# EasyEDA schematic SCH_Nixie clock - v2_2021-07-23.json

## Sheets
1 Circuit diagram - v2
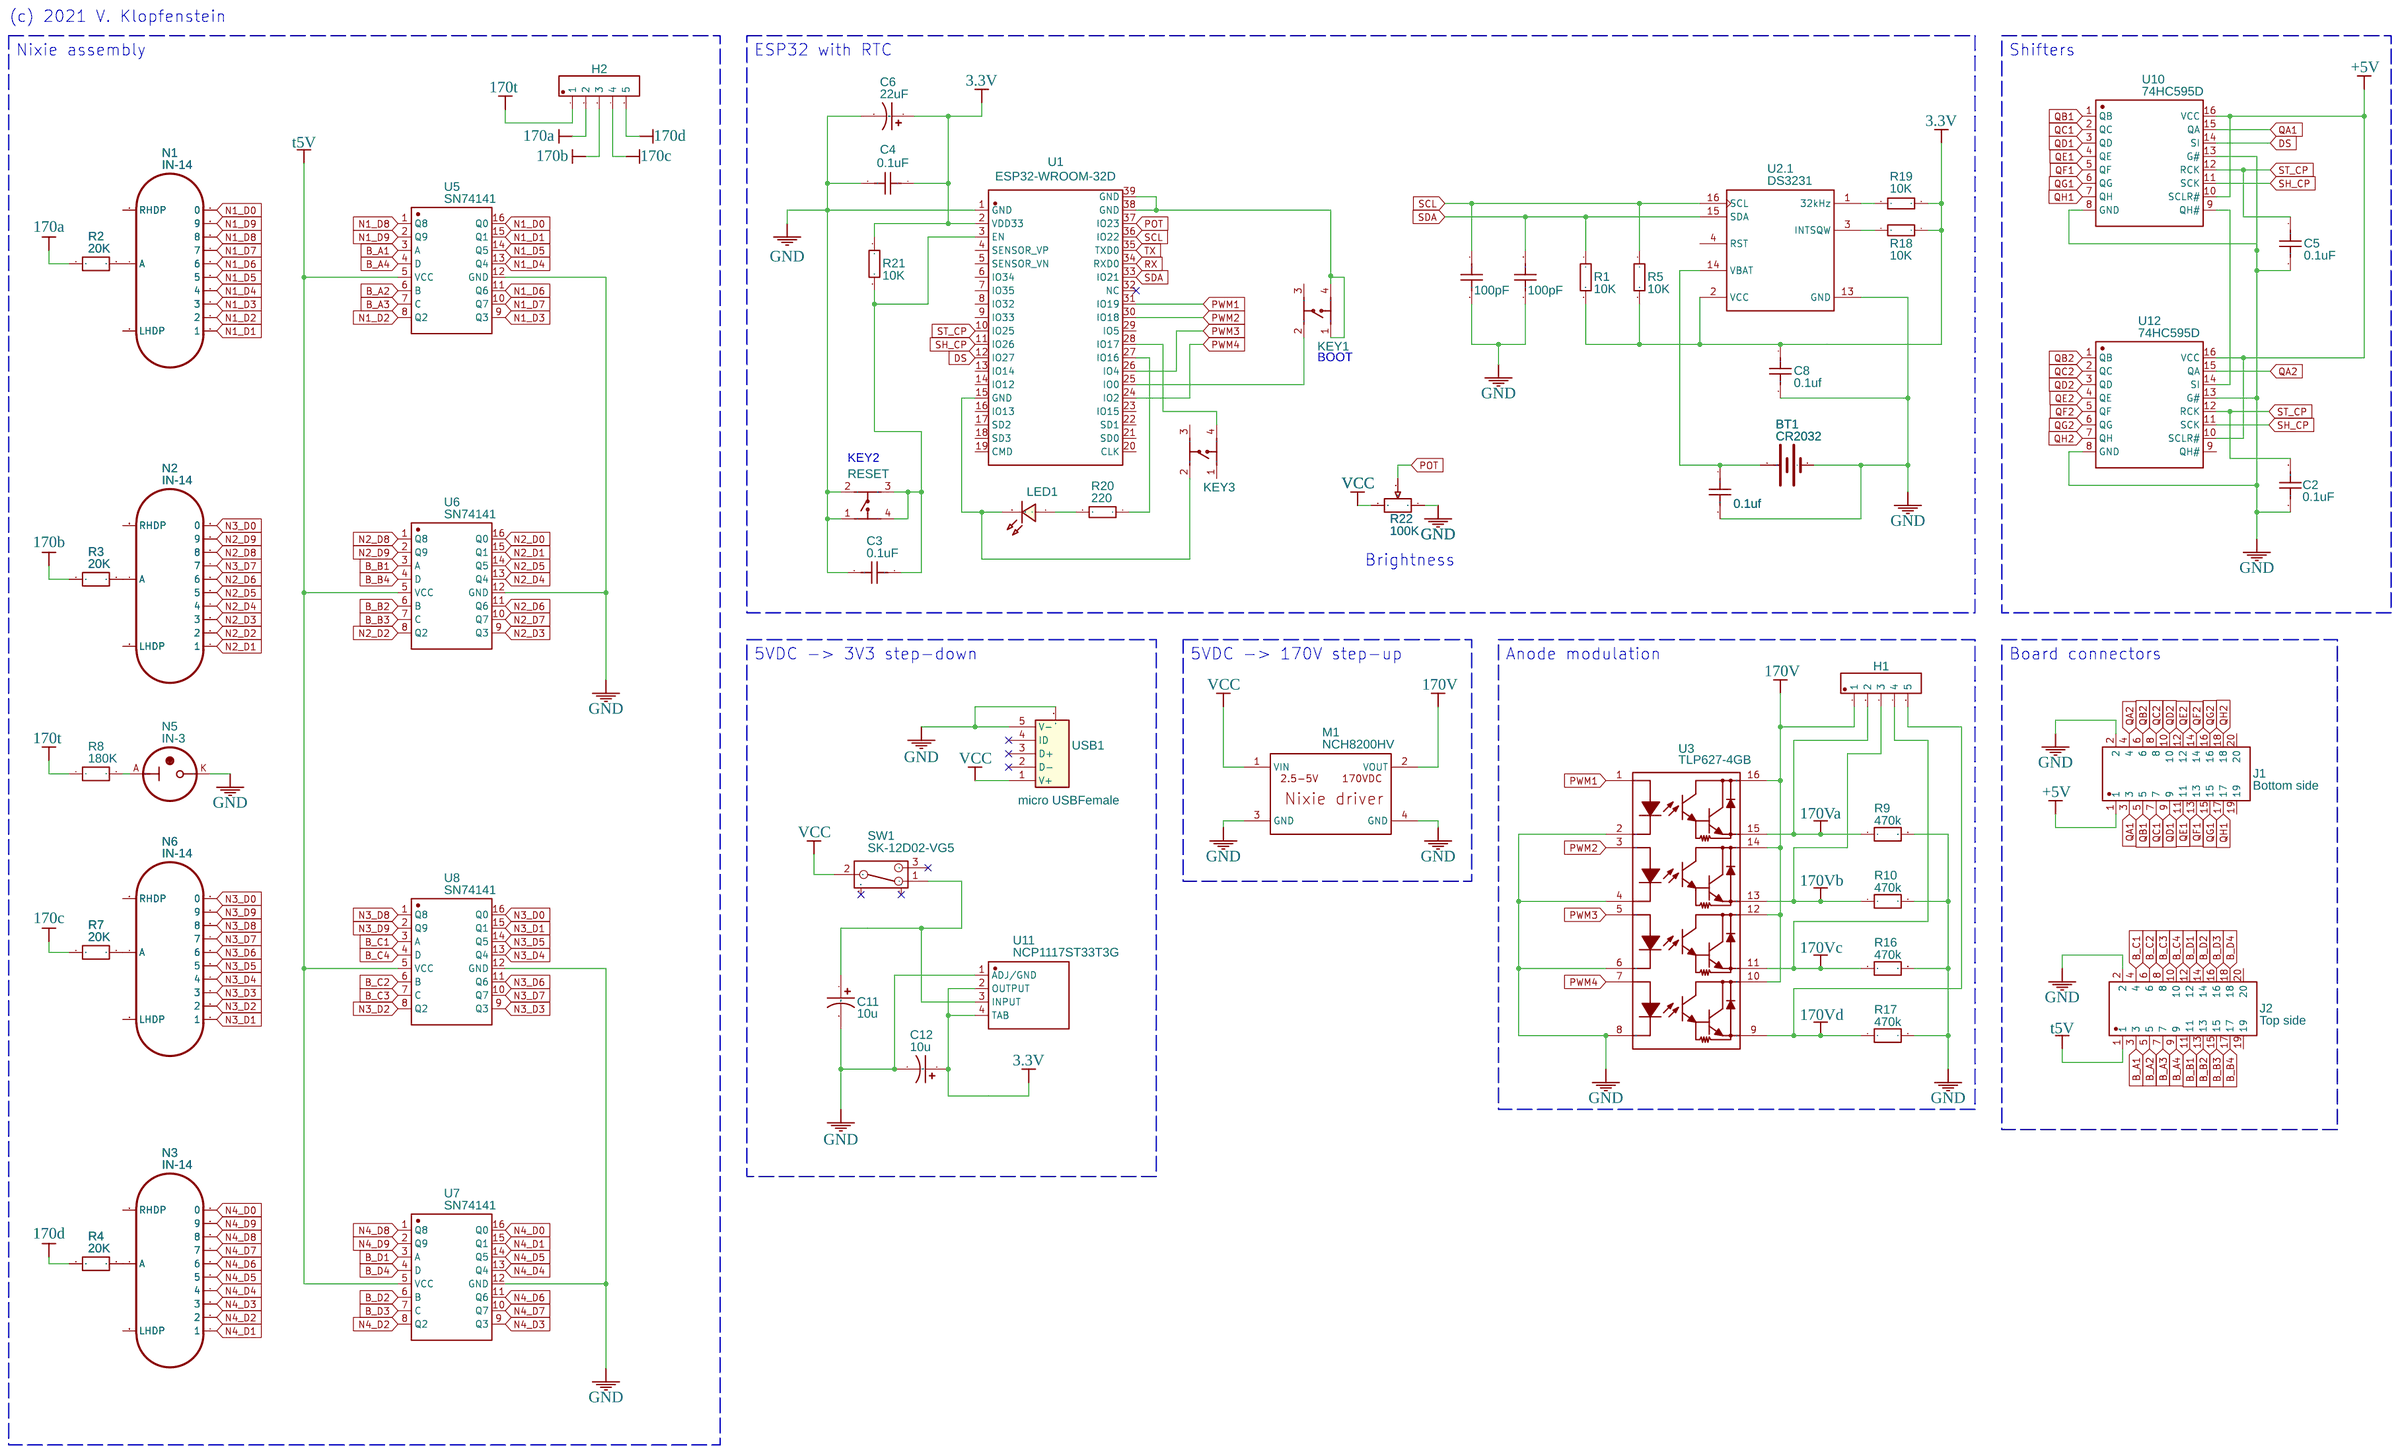
[diagram p0: Circuit diagram - v2]
2 Circuit diagram
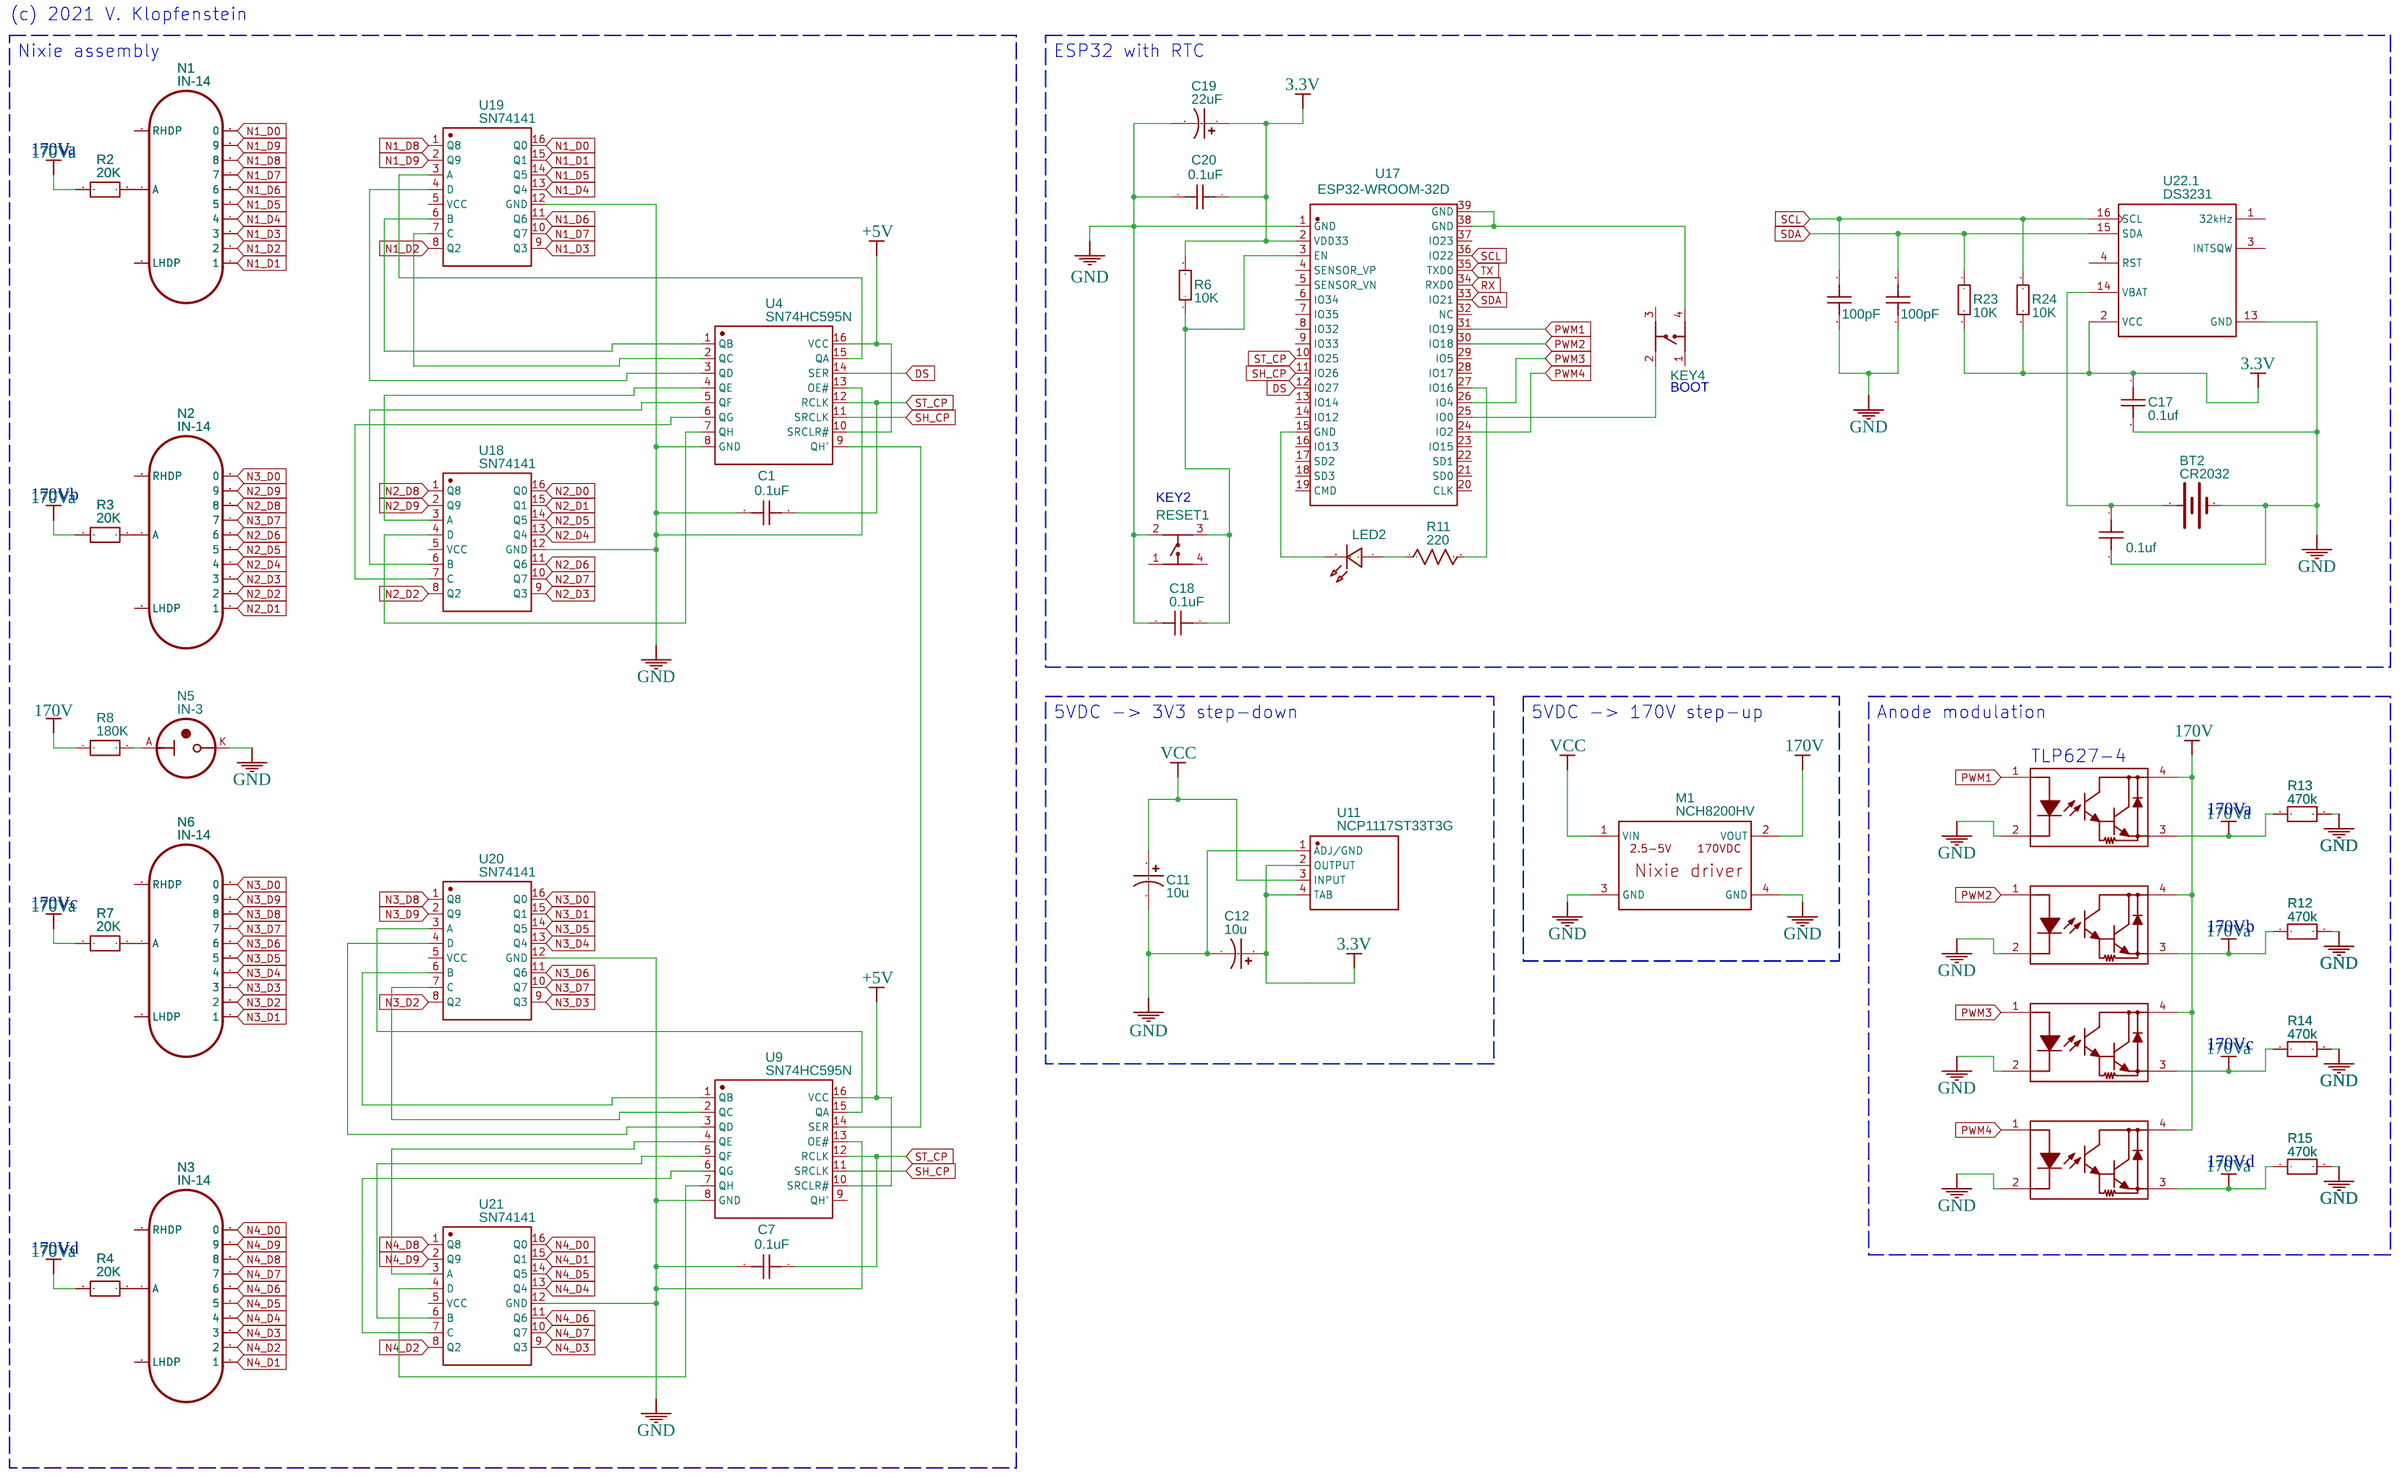
[diagram p1: Circuit diagram]

## Parts
sheet Circuit diagram - v2
BT1  CR2032  [BAT-TH_KEYSTONE-103]
C2  0.1uF  [C0603]
C3  0.1uF  [C0603]
C4  0.1uF  [C0603]
C5  0.1uF  [C0603]
C6  22uF  [CAP-TH_BD8.0-P3.50-D1.0-FD]
C8  0.1uf  [C0603]
C11  10u  [CASE-B_3528]
C12  10u  [CASE-B_3528]
C13  100pF  [C0603]
C14  100pF  [C0603]
C15  0.1uf  [CAP-TH_L5.5-W2.0-P5.00-D1.0]
H1  Male Header 1*5P  [MALE HEADER 5P]
H2  Male Header 1*5P  [MALE HEADER 5P]
J1  Bottom side  [CONN-TH_300S-20P]
J2  Top side  [CONN-TH_300S-20P]
KEY1  TSA063G50-250  [KEY-SMD_4P-L6.0-W6.0-P4.50-LS10.0]
KEY3  TSA063G50-250  [KEY-SMD_4P-L6.0-W6.0-P4.50-LS10.0]
LED1  LED-0603_R  [LED0603_RED]
M1  NCH8200HV  [NCH8200HV]
N1  IN-14  [IN-14]
N2  IN-14  [IN-14]
N3  IN-14  [IN-14]
N5  IN-3  [IN-3]
N6  IN-14  [IN-14]
R1  10K  [R0603]
R2  20K  [RES-TH_BD2.4-L6.3-P10.30-D0.6]
R3  20K  [RES-TH_BD2.4-L6.3-P10.30-D0.6]
R4  20K  [RES-TH_BD2.4-L6.3-P10.30-D0.6]
R5  10K  [R0603]
R7  20K  [RES-TH_BD2.4-L6.3-P10.30-D0.6]
R8  180K  [RES-TH_BD2.4-L6.3-P10.30-D0.6]
R9  470k  [R_AXIAL-0.4]
R10  470k  [R_AXIAL-0.4]
R16  470k  [R_AXIAL-0.4]
R17  470k  [R_AXIAL-0.4]
R18  10K  [R0603]
R19  10K  [R0603]
R20  220  [R0603]
R21  10K  [R0603]
R22  100K  [WH160-1-104]
RESET  TSA063G50-250  [KEY-SMD_4P-L6.0-W6.0-P4.50-LS10.0]
SW1  SK-12D02-VG5  [SW-TH_SK-12D02VG3]
U1  ESP32-WROOM-32D  [WIFIM-SMD_39P-L25.5-W18.0-P1.27-BL]
U2  DS3231  [SOIC-16_L10.3-W7.5-P1.27-LS10.3-BL]  (section 1)
U3  TLP627-4GB  [DIP-16_16P-L20.2-W6.6-P2.54-LS7.6-BL]
U5  SN74141  [DIP16]
U6  SN74141  [DIP16]
U7  SN74141  [DIP16]
U8  SN74141  [DIP16]
U10  74HC595D  [SOIC-16_L9.9-W3.9-P1.27-LS6.0-BL]
U11  NCP1117ST33T3G  [SOT-223-3_L6.5-W3.4-P2.30-LS7.0-BR]
U12  74HC595D  [SOIC-16_L9.9-W3.9-P1.27-LS6.0-BL]
USB1  micro USBFemale  [MICRO-USB-SMD_5P-P0.65-H-F_C10418]
sheet Circuit diagram
BT2  CR2032  [BAT-TH_KEYSTONE-103]
C1  0.1uF  [CAP-TH_L5.5-W2.0-P5.00-D1.0]
C7  0.1uF  [CAP-TH_L5.5-W2.0-P5.00-D1.0]
C9  0.1uf  [CAP-TH_L5.5-W2.0-P5.00-D1.0]
C10  100pF  [C0603]
C11#2  10u  [CASE-A_3216]
C12#2  10u  [CASE-A_3216]
C16  100pF  [C0603]
C17  0.1uf  [CAP-TH_L5.5-W2.0-P5.00-D1.0]
C18  0.1uF  [CAP-TH_L5.5-W2.0-P5.00-D1.0]
C19  22uF  [CAP-TH_BD8.0-P3.50-D1.0-FD]
C20  0.1uF  [CAP-TH_L5.5-W2.0-P5.00-D1.0]
KEY4  TSA063G50-250  [KEY-SMD_4P-L6.0-W6.0-P4.50-LS10.0]
LED2  LED-0603_R  [LED0603_RED]
M1#2  NCH8200HV  [NCH8200HV]
N1#2  IN-14  [IN-14]
N2#2  IN-14  [IN-14]
N3#2  IN-14  [IN-14]
N5#2  IN-3  [IN-3]
N6#2  IN-14  [IN-14]
R2#2  20K  [RES-TH_BD2.4-L6.3-P10.30-D0.6]
R3#2  20K  [RES-TH_BD2.4-L6.3-P10.30-D0.6]
R4#2  20K  [RES-TH_BD2.4-L6.3-P10.30-D0.6]
R6  10K  [RES-TH_BD2.2-L6.5-P10.50-D0.6]
R7#2  20K  [RES-TH_BD2.4-L6.3-P10.30-D0.6]
R8#2  180K  [RES-TH_BD2.4-L6.3-P10.30-D0.6]
R11  220  [R0603]
R12  470k  [R0603]
R13  470k  [R0603]
R14  470k  [R0603]
R15  470k  [R0603]
R23  10K  [RES-TH_BD2.2-L6.5-P10.50-D0.6]
R24  10K  [RES-TH_BD2.2-L6.5-P10.50-D0.6]
RESET1  TSA063G50-250  [KEY-SMD_4P-L6.0-W6.0-P4.50-LS10.0]
U4  SN74HC595N  [DIP-16_L19.8-W6.5-P2.54-LS7.6-BL]
U9  SN74HC595N  [DIP-16_L19.8-W6.5-P2.54-LS7.6-BL]
U11#2  NCP1117ST33T3G  [SOT-223-3_L6.5-W3.4-P2.30-LS7.0-BR]
U13  TLP627(TP1,F)  [OPTO-SMD-4_L4.6-W6.5-P2.54-LS10.3-BL]
U14  TLP627(TP1,F)  [OPTO-SMD-4_L4.6-W6.5-P2.54-LS10.3-BL]
U15  TLP627(TP1,F)  [OPTO-SMD-4_L4.6-W6.5-P2.54-LS10.3-BL]
U16  TLP627(TP1,F)  [OPTO-SMD-4_L4.6-W6.5-P2.54-LS10.3-BL]
U17  ESP32-WROOM-32D  [WIFIM-SMD_39P-L25.5-W18.0-P1.27-BL]
U18  SN74141  [DIP16]
U19  SN74141  [DIP16]
U20  SN74141  [DIP16]
U21  SN74141  [DIP16]
U22  DS3231  [SOIC-16_L10.3-W7.5-P1.27-LS10.3-BL]  (section 1)

## Library data of the parts
BT1 BT2 = 103_C238065: Supplier: LCSC; Supplier Part: C238065; Manufacturer: Keystone; Manufacturer Part: 103; Contributor: LCSC; LCSC Assembly: Yes; SMT Type: Extend; Paste Type: expand
C1-C5 C7-C9 C15 C17 C18 C20 = CC1H104ZC1PD3F5P3003: Supplier: LCSC; Supplier Part: C353904; Manufacturer: Dersonic; Contributor: LCSC; LCSC Assembly: Yes; SMT Type: Extend; Paste Type: expand
C6 C19 = ECE2CM220F16OTPO: Supplier: LCSC; Supplier Part: C525473; Manufacturer: Yunxing; Contributor: LCSC
C11 C11#2 C12 C12#2 = C_Tan_SMD_A_US: Contributor: LCEDA_Lib
C10 C13 C14 C16 = C_0603_US: Contributor: LCEDA_Lib
H1 H2 = Male Header 1*5P: Manufacturer: Ckmtw; Manufacturer Part: 210S-1*5P L=11.6MMGold-plated black; Contributor: R1S8K LLTP; LCSC Assembly: Yes; SMT Type: Extend
J1 J2 = Female header2*10P: Supplier: LCSC; Manufacturer: BOOMELE; Supplier Part: C75756
KEY1 KEY3 KEY4 RESET RESET1 = TSA063G50-250: Supplier: LCSC; Supplier Part: C294565; Manufacturer: BRIGHT; Contributor: LCSC; Paste Type: expand
LED1 LED2 = LED-0603_R: Manufacturer: EVERLIGHT(台湾亿光); Manufacturer Part: 19-217/R6C-AL1M2VY/3T; Supplier Part: C72044; Supplier: LCSC; Contributor: LCEDA_01
M1 M1#2 = NCH8200HV: Manufacturer Part: New SchematicLib; Contributor: CuriousSpark; Supplier: NixieClock; link: http://www.nixieclock.org/upload/NCH8200HV%20Datasheet%20EN%20v2.0.0.pdf
N1 N1#2 N2 N2#2 N3 N3#2 N6 N6#2 = IN-14: Contributor: lucabalda70
N5 N5#2 = IN-3: Contributor: JoChevy
R1 R5 R6 R18-R21 R23 R24 = CFR0W4J0103A50: Supplier: LCSC; Manufacturer: UniOhm; Supplier Part: C61299; LCSC Assembly: Yes; SMT Type: Extend; Paste Type: expand
R2 R2#2 R3 R3#2 R4 R4#2 R7 R7#2 R8 R8#2 = RD 1/4W 20K J T/B A1: Supplier: LCSC; Supplier Part: C433753; Manufacturer: TyoHM; Contributor: LCSC; LCSC Assembly: Yes; SMT Type: Extend; Paste Type: expand
R9 R10 R12-R17 = R_0603_EU: Contributor: LCEDA_Lib
R22 = Wheel potentiometer: Supplier: LCSC; Manufacturer: JML; Manufacturer Part: Potentiometer WH160-1-104; Supplier Part: C61836; Contributor: Kitchacircuit
SW1 = SK-12D02-VG5: Supplier: LCSC; Supplier Part: C136722; Manufacturer: Rectangular Connectors - Contacts; Contributor: LCSC
U1 U17 = ESP32-WROOM-32D: Supplier: LCSC; Supplier Part: C473012; Manufacturer: ESPRESSIF 乐鑫; Contributor: LCSC; Paste Type: expand
U2 U22 = DS3231M+TRL: tags: Clock; Supplier Part: C37663; Supplier: LCSC; Manufacturer: MAXIM; subpart_no: 1; image: http://image.lceda.cn/szlcsc/C37663.jpg
U3 = TLP627-4GB: Supplier: LCSC; Manufacturer: TOSHIBA; Supplier Part: C9201
U5-U8 U18-U21 = SN74141 NIXIE HV+ DRIVER: Contributor: David Hovannesian
U10 U12 = 74HC595D: Supplier: LCSC; Manufacturer: FM; Supplier Part: C86609; Paste Type: Extended Part; JLCPCB Part Class: Extended Part
U11 U11#2 = NCP1117ST33T3G: Supplier: LCSC; Manufacturer: ON; image: //image.lceda.cn/szlcsc/C26537.jpg; Supplier Part: C26537; SMT Type: Extend; JLCPCB SMD: Yes; Paste Type: recommend
USB1 = micro USBFemale: Supplier: LCSC; Manufacturer: ValuePro; Supplier Part: C10418; JLCPCB Part Class: Extended Part
R11 = R_0603_US: Contributor: LCEDA_Lib
U4 U9 = SN74HC595N: Supplier: LCSC; Manufacturer: TI; image: //image.lceda.cn/szlcsc/C78711.jpg; Supplier Part: C78711
U13-U16 = TLP627(TP1,F): Supplier: LCSC; Manufacturer: TOSHIBA; Supplier Part: C30336; JLCPCB Part Class: Extended Part

## Nets
3.3V: C4.1 C6.1 C8.1 C12.1 C12#2.1 C17.1 C19.1 C20.1 R1.2 R5.2 R6.2 R18.1 R19.1 R21.1 R23.2 R24.2 U1.2(VDD33) U2.2(VCC) U11.2(OUTPUT) U11.4(TAB) U11#2.2(OUTPUT) U11#2.4(TAB) U17.2(VDD33) U22.2(VCC)
170V: H1.1 M1.2(VOUT) M1#2.2(VOUT) R8#2.1 U3.10 U3.12 U3.14 U3.16 U13.4 U14.4 U15.4 U16.4
170Va: H1.2 R2#2.1 R3#2.1 R4#2.1 R7#2.1 R9.1 R12.1 R13.1 R14.1 R15.1 U3.15 U13.3 U14.3 U15.3 U16.3
170Vb: H1.3 R10.1 U3.13
170Vc: H1.4 R16.1 U3.11
170Vd: H1.5 R17.1 U3.9
+5V: J1.1 U4.10(SRCLR#) U4.16(VCC) U9.10(SRCLR#) U9.16(VCC) U10.10(SCLR#) U10.16(VCC) U12.10(SCLR#) U12.16(VCC)
GND: BT1.2(-) BT2.2(-) C1.2 C2.1 C3.2 C4.2 C5.2 C6.2 C7.2 C8.2 C9.2 C10.2 C11.2 C11#2.2 C12.2 C12#2.2 C13.1 C14.2 C15.2 C16.1 C17.2 C18.2 C19.2 C20.2 J1.2 J2.2 M1.3(GND) M1.4(GND) M1#2.3(GND) M1#2.4(GND) N5.K N5#2.K R9.2 R10.2 R12.2 R13.2 R14.2 R15.2 R16.2 R17.2 R22.1 RESET.1 RESET.2 RESET1.2 U1.1(GND) U2.13(GND) U3.2 U3.4 U3.6 U3.8 U4.8(GND) U4.13(OE#) U5.12(GND) U6.12(GND) U7.12(GND) U8.12(GND) U9.8(GND) U9.13(OE#) U10.8(GND) U10.13(G#) U11.1(ADJ/GND) U11#2.1(ADJ/GND) U12.8(GND) U12.13(G#) U13.2 U14.2 U15.2 U16.2 U17.1(GND) U18.12(GND) U19.12(GND) U20.12(GND) U21.12(GND) U22.13(GND) USB1.0(MTN) USB1.5(V-)
VCC: C11#2.1 M1.1(VIN) M1#2.1(VIN) R22.3 SW1.2 U11#2.3(INPUT) USB1.1(V+)
170a: H2.2 R2.1
170b: H2.3 R3.1
170c: H2.4 R7.1
170d: H2.5 R4.1
170t: H2.1 R8.1
B_A1: J2.3 U5.3(A)
B_A2: J2.5 U5.6(B)
B_A3: J2.7 U5.7(C)
B_A4: J2.9 U5.4(D)
B_B1: J2.11 U6.3(A)
B_B2: J2.13 U6.6(B)
B_B3: J2.15 U6.7(C)
B_B4: J2.17 U6.4(D)
B_C1: J2.4 U8.3(A)
B_C2: J2.6 U8.6(B)
B_C3: J2.8 U8.7(C)
B_C4: J2.10 U8.4(D)
B_D1: J2.12 U7.3(A)
B_D2: J2.14 U7.6(B)
B_D3: J2.16 U7.7(C)
B_D4: J2.18 U7.4(D)
DS: U1.12(IO27) U4.14(SER) U10.14(SI) U17.12(IO27)
N1_D0: N1.0 N1#2.0 U5.16(Q0) U19.16(Q0)
N1_D1: N1.1 N1#2.1 U5.15(Q1) U19.15(Q1)
N1_D2: N1.2 N1#2.2 U5.8(Q2) U19.8(Q2)
N1_D3: N1.3 N1#2.3 U5.9(Q3) U19.9(Q3)
N1_D4: N1.4 N1#2.4 U5.13(Q4) U19.13(Q4)
N1_D5: N1.5 N1#2.5 U5.14(Q5) U19.14(Q5)
N1_D6: N1.6 N1#2.6 U5.11(Q6) U19.11(Q6)
N1_D7: N1.7 N1#2.7 U5.10(Q7) U19.10(Q7)
N1_D8: N1.8 N1#2.8 U5.1(Q8) U19.1(Q8)
N1_D9: N1.9 N1#2.9 U5.2(Q9) U19.2(Q9)
N2_D0: U6.16(Q0) U18.16(Q0)
N2_D1: N2.1 N2#2.1 U6.15(Q1) U18.15(Q1)
N2_D2: N2.2 N2#2.2 U6.8(Q2) U18.8(Q2)
N2_D3: N2.3 N2#2.3 U6.9(Q3) U18.9(Q3)
N2_D4: N2.4 N2#2.4 U6.13(Q4) U18.13(Q4)
N2_D5: N2.5 N2#2.5 U6.14(Q5) U18.14(Q5)
N2_D6: N2.6 N2#2.6 U6.11(Q6) U18.11(Q6)
N2_D7: U6.10(Q7) U18.10(Q7)
N2_D8: N2.8 N2#2.8 U6.1(Q8) U18.1(Q8)
N2_D9: N2.9 N2#2.9 U6.2(Q9) U18.2(Q9)
N3_D0: N2.0 N2#2.0 N6.0 N6#2.0 U8.16(Q0) U20.16(Q0)
N3_D1: N6.1 N6#2.1 U8.15(Q1) U20.15(Q1)
N3_D2: N6.2 N6#2.2 U8.8(Q2) U20.8(Q2)
N3_D3: N6.3 N6#2.3 U8.9(Q3) U20.9(Q3)
N3_D4: N6.4 N6#2.4 U8.13(Q4) U20.13(Q4)
N3_D5: N6.5 N6#2.5 U8.14(Q5) U20.14(Q5)
N3_D6: N6.6 N6#2.6 U8.11(Q6) U20.11(Q6)
N3_D7: N2.7 N2#2.7 N6.7 N6#2.7 U8.10(Q7) U20.10(Q7)
N3_D8: N6.8 N6#2.8 U8.1(Q8) U20.1(Q8)
N3_D9: N6.9 N6#2.9 U8.2(Q9) U20.2(Q9)
N4_D0: N3.0 N3#2.0 U7.16(Q0) U21.16(Q0)
N4_D1: N3.1 N3#2.1 U7.15(Q1) U21.15(Q1)
N4_D2: N3.2 N3#2.2 U7.8(Q2) U21.8(Q2)
N4_D3: N3.3 N3#2.3 U7.9(Q3) U21.9(Q3)
N4_D4: N3.4 N3#2.4 U7.13(Q4) U21.13(Q4)
N4_D5: N3.5 N3#2.5 U7.14(Q5) U21.14(Q5)
N4_D6: N3.6 N3#2.6 U7.11(Q6) U21.11(Q6)
N4_D7: N3.7 N3#2.7 U7.10(Q7) U21.10(Q7)
N4_D8: N3.8 N3#2.8 U7.1(Q8) U21.1(Q8)
N4_D9: N3.9 N3#2.9 U7.2(Q9) U21.2(Q9)
POT: R22.2 U1.37(IO23)
PWM1: U1.31(IO19) U3.1 U13.1 U17.31(IO19)
PWM2: U1.30(IO18) U3.3 U14.1 U17.30(IO18)
PWM3: U1.26(IO4) U3.5 U16.1 U17.26(IO4)
PWM4: U1.24(IO2) U3.7 U15.1 U17.24(IO2)
QA1: J1.3 U10.15(QA)
QA2: J1.4 U12.15(QA)
QB1: J1.5 U10.1(QB)
QB2: J1.6 U12.1(QB)
QC1: J1.7 U10.2(QC)
QC2: J1.8 U12.2(QC)
QD1: J1.9 U10.3(QD)
QD2: J1.10 U12.3(QD)
QE1: J1.11 U10.4(QE)
QE2: J1.12 U12.4(QE)
QF1: J1.13 U10.5(QF)
QF2: J1.14 U12.5(QF)
QG1: J1.15 U10.6(QG)
QG2: J1.16 U12.6(QG)
QH1: J1.17 U10.7(QH)
QH2: J1.18 U12.7(QH)
RX: U1.34(RXD0) U17.34(RXD0)
SCL: C10.1 C14.1 R5.1 R24.1 U1.36(IO22) U2.16(SCL) U17.36(IO22) U22.16(SCL)
SDA: C13.2 C16.2 R1.1 R23.1 U1.33(IO21) U2.15(SDA) U17.33(IO21) U22.15(SDA)
SH_CP: U1.11(IO26) U4.11(SRCLK) U9.11(SRCLK) U10.11(SCK) U12.11(SCK) U17.11(IO26)
ST_CP: C1.1 C2.2 C5.1 C7.1 U1.10(IO25) U4.12(RCLK) U9.12(RCLK) U10.12(RCK) U12.12(RCK) U17.10(IO25)
t5V: J2.1 U5.5(VCC) U6.5(VCC) U7.5(VCC) U8.5(VCC)
TX: U1.35(TXD0) U17.35(TXD0)
Net-(BT1-1): BT1.1(+) C15.1 U2.14(VBAT)
Net-(BT2-1): BT2.1(+) C9.1 U22.14(VBAT)
Net-(C3-1): C3.1 R21.2 RESET.3 RESET.4 U1.3(EN)
Net-(C11-1): C11.1 SW1.1 U11.3(INPUT)
Net-(C18-1): C18.1 R6.1 RESET1.3 U17.3(EN)
Net-(KEY1-1): KEY1.1 KEY1.4 U1.38(GND) U1.39(GND)
Net-(KEY1-2): KEY1.2 U1.25(IO0)
Net-(KEY3-2): KEY3.2 LED1.2 U1.15(GND)
Net-(KEY3-4): KEY3.4 U1.28(IO17)
Net-(KEY4-2): KEY4.2 U17.25(IO0)
Net-(KEY4-4): KEY4.4 U17.38(GND) U17.39(GND)
Net-(LED1-1): LED1.1 R20.2
Net-(LED2-1): LED2.1 R11.1
Net-(LED2-2): LED2.2 U17.15(GND)
Net-(N1#2-A): N1#2.A R2#2.2
Net-(N1-A): N1.A R2.2
Net-(N2#2-A): N2#2.A R3#2.2
Net-(N2-A): N2.A R3.2
Net-(N3#2-A): N3#2.A R4#2.2
Net-(N3-A): N3.A R4.2
Net-(N5#2-A): N5#2.A R8#2.2
Net-(N5-A): N5.A R8.2
Net-(N6#2-A): N6#2.A R7#2.2
Net-(N6-A): N6.A R7.2
Net-(R11-2): R11.2 U17.27(IO16)
Net-(R18-2): R18.2 U2.3(INTSQW)
Net-(R19-2): R19.2 U2.1(32kHz)
Net-(R20-1): R20.1 U1.27(IO16)
Net-(U4-1): U4.1(QB) U19.6(B)
Net-(U4-2): U4.2(QC) U19.7(C)
Net-(U4-3): U4.3(QD) U19.4(D)
Net-(U4-4): U4.4(QE) U18.3(A)
Net-(U4-5): U4.5(QF) U18.6(B)
Net-(U4-6): U4.6(QG) U18.7(C)
Net-(U4-7): U4.7(QH) U18.4(D)
Net-(U4-9): U4.9(QH') U9.14(SER)
Net-(U4-15): U4.15(QA) U19.3(A)
Net-(U9-1): U9.1(QB) U20.6(B)
Net-(U9-2): U9.2(QC) U20.7(C)
Net-(U9-3): U9.3(QD) U20.4(D)
Net-(U9-4): U9.4(QE) U21.3(A)
Net-(U9-5): U9.5(QF) U21.6(B)
Net-(U9-6): U9.6(QG) U21.7(C)
Net-(U9-7): U9.7(QH) U21.4(D)
Net-(U9-15): U9.15(QA) U20.3(A)
Net-(U10-9): U10.9(QH#) U12.14(SI)

Not connected (* = marked no-connect by the designer): J1 19 20; J2 19 20; KEY1 3; KEY3 1 3; KEY4 1 3; N1 LHDP RHDP; N1#2 LHDP RHDP; N2 LHDP RHDP; N2#2 LHDP RHDP; N3 LHDP RHDP; N3#2 LHDP RHDP; N6 LHDP RHDP; N6#2 LHDP RHDP; RESET1 1 4; SW1 3* 4* 5*; U1 4(SENSOR_VP) 5(SENSOR_VN) 6(IO34) 7(IO35) 8(IO32) 9(IO33) 13(IO14) 14(IO12) 16(IO13) 17(SD2) 18(SD3) 19(CMD) 20(CLK) 21(SD0) 22(SD1) 23(IO15) 29(IO5) 32(NC)*; U2 4(RST); U9 9(QH'); U12 9(QH#); U17 4(SENSOR_VP) 5(SENSOR_VN) 6(IO34) 7(IO35) 8(IO32) 9(IO33) 13(IO14) 14(IO12) 16(IO13) 17(SD2) 18(SD3) 19(CMD) 20(CLK) 21(SD0) 22(SD1) 23(IO15) 28(IO17) 29(IO5) 32(NC) 37(IO23); U18 5(VCC); U19 5(VCC); U20 5(VCC); U21 5(VCC); U22 1(32kHz) 3(INTSQW) 4(RST); USB1 2(D-)* 3(D+)* 4(ID)*

## Notes on the sheets
sheet 1
- (c) 2021 V. Klopfenstein
- Nixie assembly
- ESP32 with RTC
- Shifters
- BOOT
- KEY2
- Brightness
- 5VDC -> 3V3 step-down
- 5VDC -> 170V step-up
- Anode modulation
- Board connectors
sheet 2
- (c) 2021 V. Klopfenstein
- Nixie assembly
- ESP32 with RTC
- 170Va
- BOOT
- 170Vb
- KEY2
- 5VDC -> 3V3 step-down
- 5VDC -> 170V step-up
- Anode modulation
- TLP627-4
- 170Va
- 170Vc
- 170Vb
- 170Vc
- 170Vd
- 170Vd
